# Altium schematic sheet K7410tFFG900Power.SchDoc
size A3
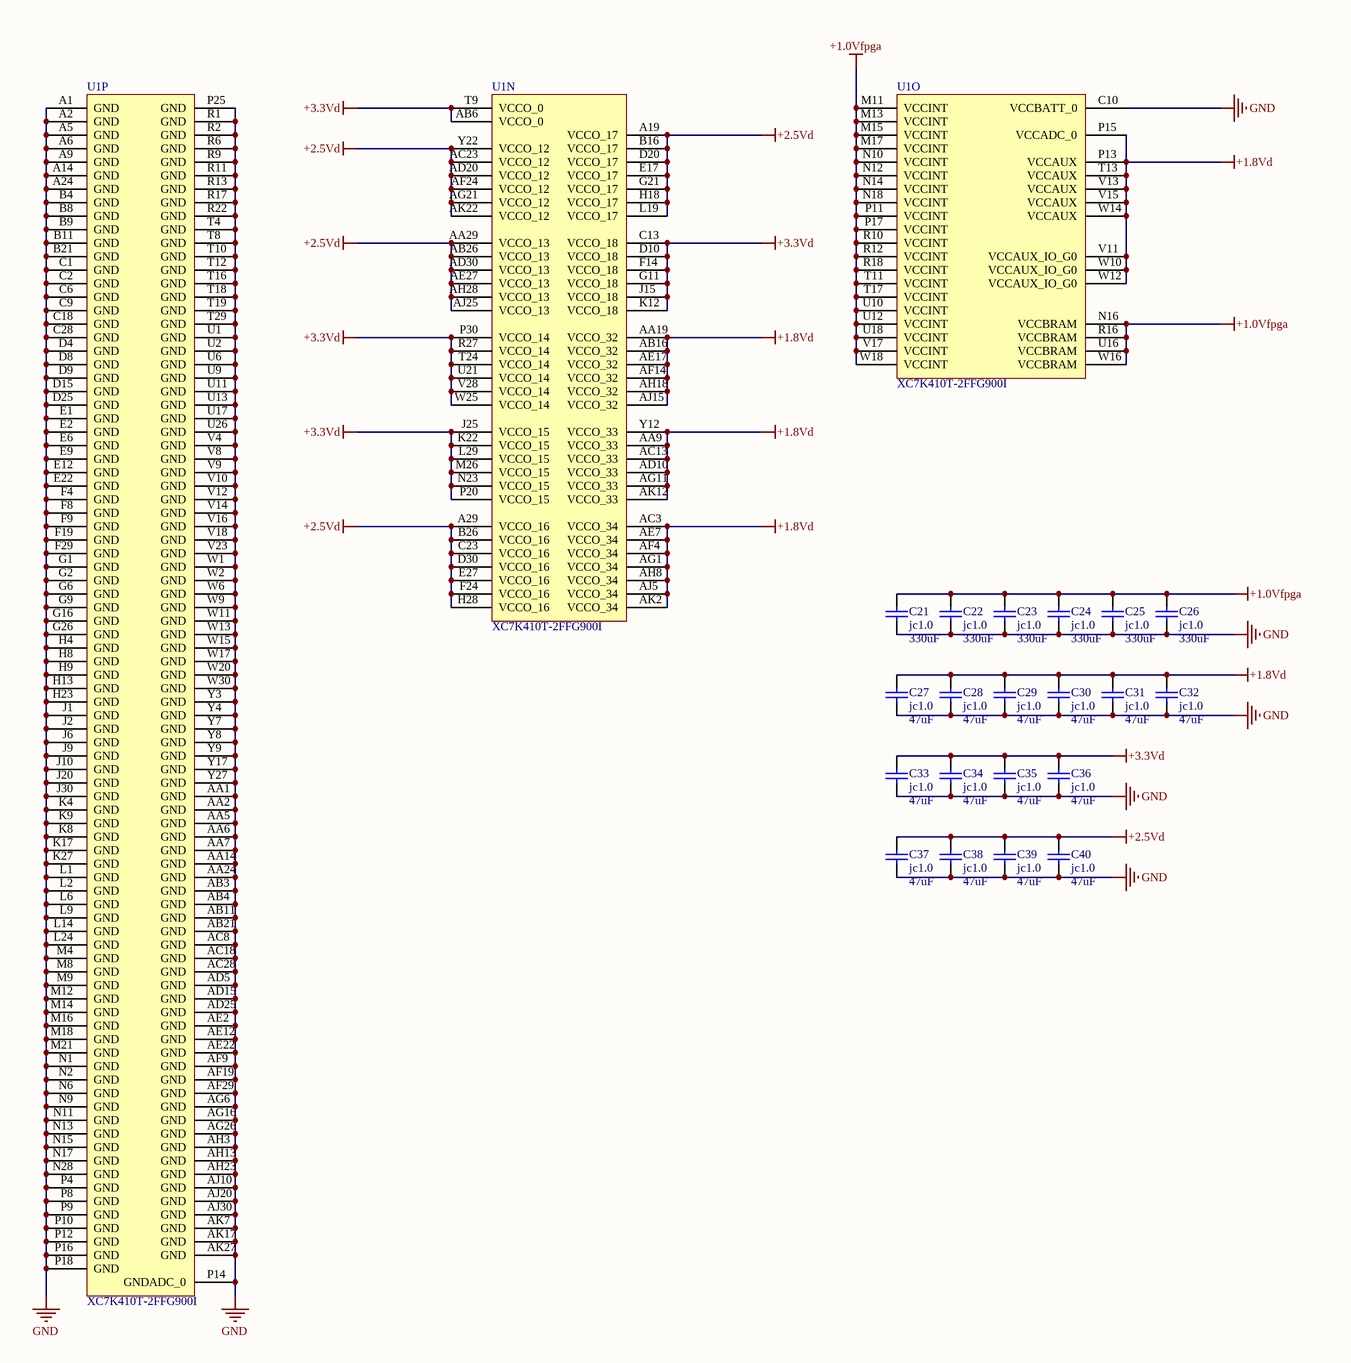
[diagram p0: K7410tFFG900Power.SchDoc]

## Parts
C21  jc1.0  value 330uF  [2220]
C22  jc1.0  value 330uF  [2220]
C23  jc1.0  value 330uF  [2220]
C24  jc1.0  value 330uF  [2220]
C25  jc1.0  value 330uF  [2220]
C26  jc1.0  value 330uF  [2220]
C27  jc1.0  value 47uF  [1210]
C28  jc1.0  value 47uF  [1210]
C29  jc1.0  value 47uF  [1210]
C30  jc1.0  value 47uF  [1210]
C31  jc1.0  value 47uF  [1210]
C32  jc1.0  value 47uF  [1210]
C33  jc1.0  value 47uF  [1210]
C34  jc1.0  value 47uF  [1210]
C35  jc1.0  value 47uF  [1210]
C36  jc1.0  value 47uF  [1210]
C37  jc1.0  value 47uF  [1210]
C38  jc1.0  value 47uF  [1210]
C39  jc1.0  value 47uF  [1210]
C40  jc1.0  value 47uF  [1210]
U1  XC7K410T-2FFG900I  [FFG900]  (parts N,O,P of 16)

## Nets
+1.0Vfpga: C21.2 C22.2 C23.2 C24.2 C25.2 C26.2 U1.M11(VCCINT) U1.M13(VCCINT) U1.M15(VCCINT) U1.M17(VCCINT) U1.N10(VCCINT) U1.N12(VCCINT) U1.N14(VCCINT) U1.N16(VCCBRAM) U1.N18(VCCINT) U1.P11(VCCINT) U1.P17(VCCINT) U1.R10(VCCINT) U1.R12(VCCINT) U1.R16(VCCBRAM) U1.R18(VCCINT) U1.T11(VCCINT) U1.T17(VCCINT) U1.U10(VCCINT) U1.U12(VCCINT) U1.U16(VCCBRAM) U1.U18(VCCINT) U1.V17(VCCINT) U1.W16(VCCBRAM) U1.W18(VCCINT)
+1.8Vd: C27.2 C28.2 C29.2 C30.2 C31.2 C32.2 U1.AA9(VCCO_33) U1.AA19(VCCO_32) U1.AB16(VCCO_32) U1.AC3(VCCO_34) U1.AC13(VCCO_33) U1.AD10(VCCO_33) U1.AE7(VCCO_34) U1.AE17(VCCO_32) U1.AF4(VCCO_34) U1.AF14(VCCO_32) U1.AG1(VCCO_34) U1.AG11(VCCO_33) U1.AH8(VCCO_34) U1.AH18(VCCO_32) U1.AJ5(VCCO_34) U1.AJ15(VCCO_32) U1.AK2(VCCO_34) U1.AK12(VCCO_33) U1.P13(VCCAUX) U1.P15(VCCADC_0) U1.T13(VCCAUX) U1.V11(VCCAUX_IO_G0) U1.V13(VCCAUX) U1.V15(VCCAUX) U1.W10(VCCAUX_IO_G0) U1.W12(VCCAUX_IO_G0) U1.W14(VCCAUX) U1.Y12(VCCO_33)
+2.5Vd: C37.2 C38.2 C39.2 C40.2 U1.A19(VCCO_17) U1.A29(VCCO_16) U1.AA29(VCCO_13) U1.AB26(VCCO_13) U1.AC23(VCCO_12) U1.AD20(VCCO_12) U1.AD30(VCCO_13) U1.AE27(VCCO_13) U1.AF24(VCCO_12) U1.AG21(VCCO_12) U1.AH28(VCCO_13) U1.AJ25(VCCO_13) U1.AK22(VCCO_12) U1.B16(VCCO_17) U1.B26(VCCO_16) U1.C23(VCCO_16) U1.D20(VCCO_17) U1.D30(VCCO_16) U1.E17(VCCO_17) U1.E27(VCCO_16) U1.F24(VCCO_16) U1.G21(VCCO_17) U1.H18(VCCO_17) U1.H28(VCCO_16) U1.L19(VCCO_17) U1.Y22(VCCO_12)
+3.3Vd: C33.2 C34.2 C35.2 C36.2 U1.AB6(VCCO_0) U1.C13(VCCO_18) U1.D10(VCCO_18) U1.F14(VCCO_18) U1.G11(VCCO_18) U1.J15(VCCO_18) U1.J25(VCCO_15) U1.K12(VCCO_18) U1.K22(VCCO_15) U1.L29(VCCO_15) U1.M26(VCCO_15) U1.N23(VCCO_15) U1.P20(VCCO_15) U1.P30(VCCO_14) U1.R27(VCCO_14) U1.T9(VCCO_0) U1.T24(VCCO_14) U1.U21(VCCO_14) U1.V28(VCCO_14) U1.W25(VCCO_14)
GND: C21.1 C22.1 C23.1 C24.1 C25.1 C26.1 C27.1 C28.1 C29.1 C30.1 C31.1 C32.1 C33.1 C34.1 C35.1 C36.1 C37.1 C38.1 C39.1 C40.1 U1.A1(GND) U1.A2(GND) U1.A5(GND) U1.A6(GND) U1.A9(GND) U1.A14(GND) U1.A24(GND) U1.AA1(GND) U1.AA2(GND) U1.AA5(GND) U1.AA6(GND) U1.AA7(GND) U1.AA14(GND) U1.AA24(GND) U1.AB3(GND) U1.AB4(GND) U1.AB11(GND) U1.AB21(GND) U1.AC8(GND) U1.AC18(GND) U1.AC28(GND) U1.AD5(GND) U1.AD15(GND) U1.AD25(GND) U1.AE2(GND) U1.AE12(GND) U1.AE22(GND) U1.AF9(GND) U1.AF19(GND) U1.AF29(GND) U1.AG6(GND) U1.AG16(GND) U1.AG26(GND) U1.AH3(GND) U1.AH13(GND) U1.AH23(GND) U1.AJ10(GND) U1.AJ20(GND) U1.AJ30(GND) U1.AK7(GND) U1.AK17(GND) U1.AK27(GND) U1.B4(GND) U1.B8(GND) U1.B9(GND) U1.B11(GND) U1.B21(GND) U1.C1(GND) U1.C2(GND) U1.C6(GND) U1.C9(GND) U1.C10(VCCBATT_0) U1.C18(GND) U1.C28(GND) U1.D4(GND) U1.D8(GND) U1.D9(GND) U1.D15(GND) U1.D25(GND) U1.E1(GND) U1.E2(GND) U1.E6(GND) U1.E9(GND) U1.E12(GND) U1.E22(GND) U1.F4(GND) U1.F8(GND) U1.F9(GND) U1.F19(GND) U1.F29(GND) U1.G1(GND) U1.G2(GND) U1.G6(GND) U1.G9(GND) U1.G16(GND) U1.G26(GND) U1.H4(GND) U1.H8(GND) U1.H9(GND) U1.H13(GND) U1.H23(GND) U1.J1(GND) U1.J2(GND) U1.J6(GND) U1.J9(GND) U1.J10(GND) U1.J20(GND) U1.J30(GND) U1.K4(GND) U1.K8(GND) U1.K9(GND) U1.K17(GND) U1.K27(GND) U1.L1(GND) U1.L2(GND) U1.L6(GND) U1.L9(GND) U1.L14(GND) U1.L24(GND) U1.M4(GND) U1.M8(GND) U1.M9(GND) U1.M12(GND) U1.M14(GND) U1.M16(GND) U1.M18(GND) U1.M21(GND) U1.N1(GND) U1.N2(GND) U1.N6(GND) U1.N9(GND) U1.N11(GND) U1.N13(GND) U1.N15(GND) U1.N17(GND) U1.N28(GND) U1.P4(GND) U1.P8(GND) U1.P9(GND) U1.P10(GND) U1.P12(GND) U1.P14(GNDADC_0) U1.P16(GND) U1.P18(GND) U1.P25(GND) U1.R1(GND) U1.R2(GND) U1.R6(GND) U1.R9(GND) U1.R11(GND) U1.R13(GND) U1.R17(GND) U1.R22(GND) U1.T4(GND) U1.T8(GND) U1.T10(GND) U1.T12(GND) U1.T16(GND) U1.T18(GND) U1.T19(GND) U1.T29(GND) U1.U1(GND) U1.U2(GND) U1.U6(GND) U1.U9(GND) U1.U11(GND) U1.U13(GND) U1.U17(GND) U1.U26(GND) U1.V4(GND) U1.V8(GND) U1.V9(GND) U1.V10(GND) U1.V12(GND) U1.V14(GND) U1.V16(GND) U1.V18(GND) U1.V23(GND) U1.W1(GND) U1.W2(GND) U1.W6(GND) U1.W9(GND) U1.W11(GND) U1.W13(GND) U1.W15(GND) U1.W17(GND) U1.W20(GND) U1.W30(GND) U1.Y3(GND) U1.Y4(GND) U1.Y7(GND) U1.Y8(GND) U1.Y9(GND) U1.Y17(GND) U1.Y27(GND)

## Library data of the parts
C21-C40 = Cap: Capacitor; Published: 8-Jun-2000; LatestRevisionDate: 17-Jul-2002; LatestRevisionNote: Re-released for DXP Platform.; PackageReference: RAD-0.3; Publisher: Altium Limited
U1 = XC7K410T-2FFG900I: Kintex-7 FPGA, 500 User I/Os, 16 GTX, 900-Ball BGA, Speed Grade 2, Industrial Grade, Pb-Free; Manufacturer: Xilinx; GTX: 16; SelectIO HP: 150; SelectIO HR: 350; Speed Grade: -2; DatasheetVersion: v1.12; PackageVersion: Rev 1.1; PackageReference: FFG900; PackageDescription: Flip-Chip BGA, Body 31 x 31 mm, 1.0 mm Pitch; Generic Part Number: XC7K410T; RoHS: Pb-Free; Mounting Technology: Surface Mount; Code_JEDEC: MS-034-AAN-1; PartNumber: XC7K410T-2FFG900I; ComponentLink1Description: Datasheet; ComponentLink1URL: http://www.xilinx.com/support/documentation/data_sheets/ds180_7Series_Overview.pdf; ComponentLink2Description: Package Specification; ComponentLink2URL: http://www.xilinx.com/support/documentation/user_guides/ug865-Zynq-7000-Pkg-Pinout.pdf